# EAGLE design ftdi_rev_3 (EAGLE 6.3)
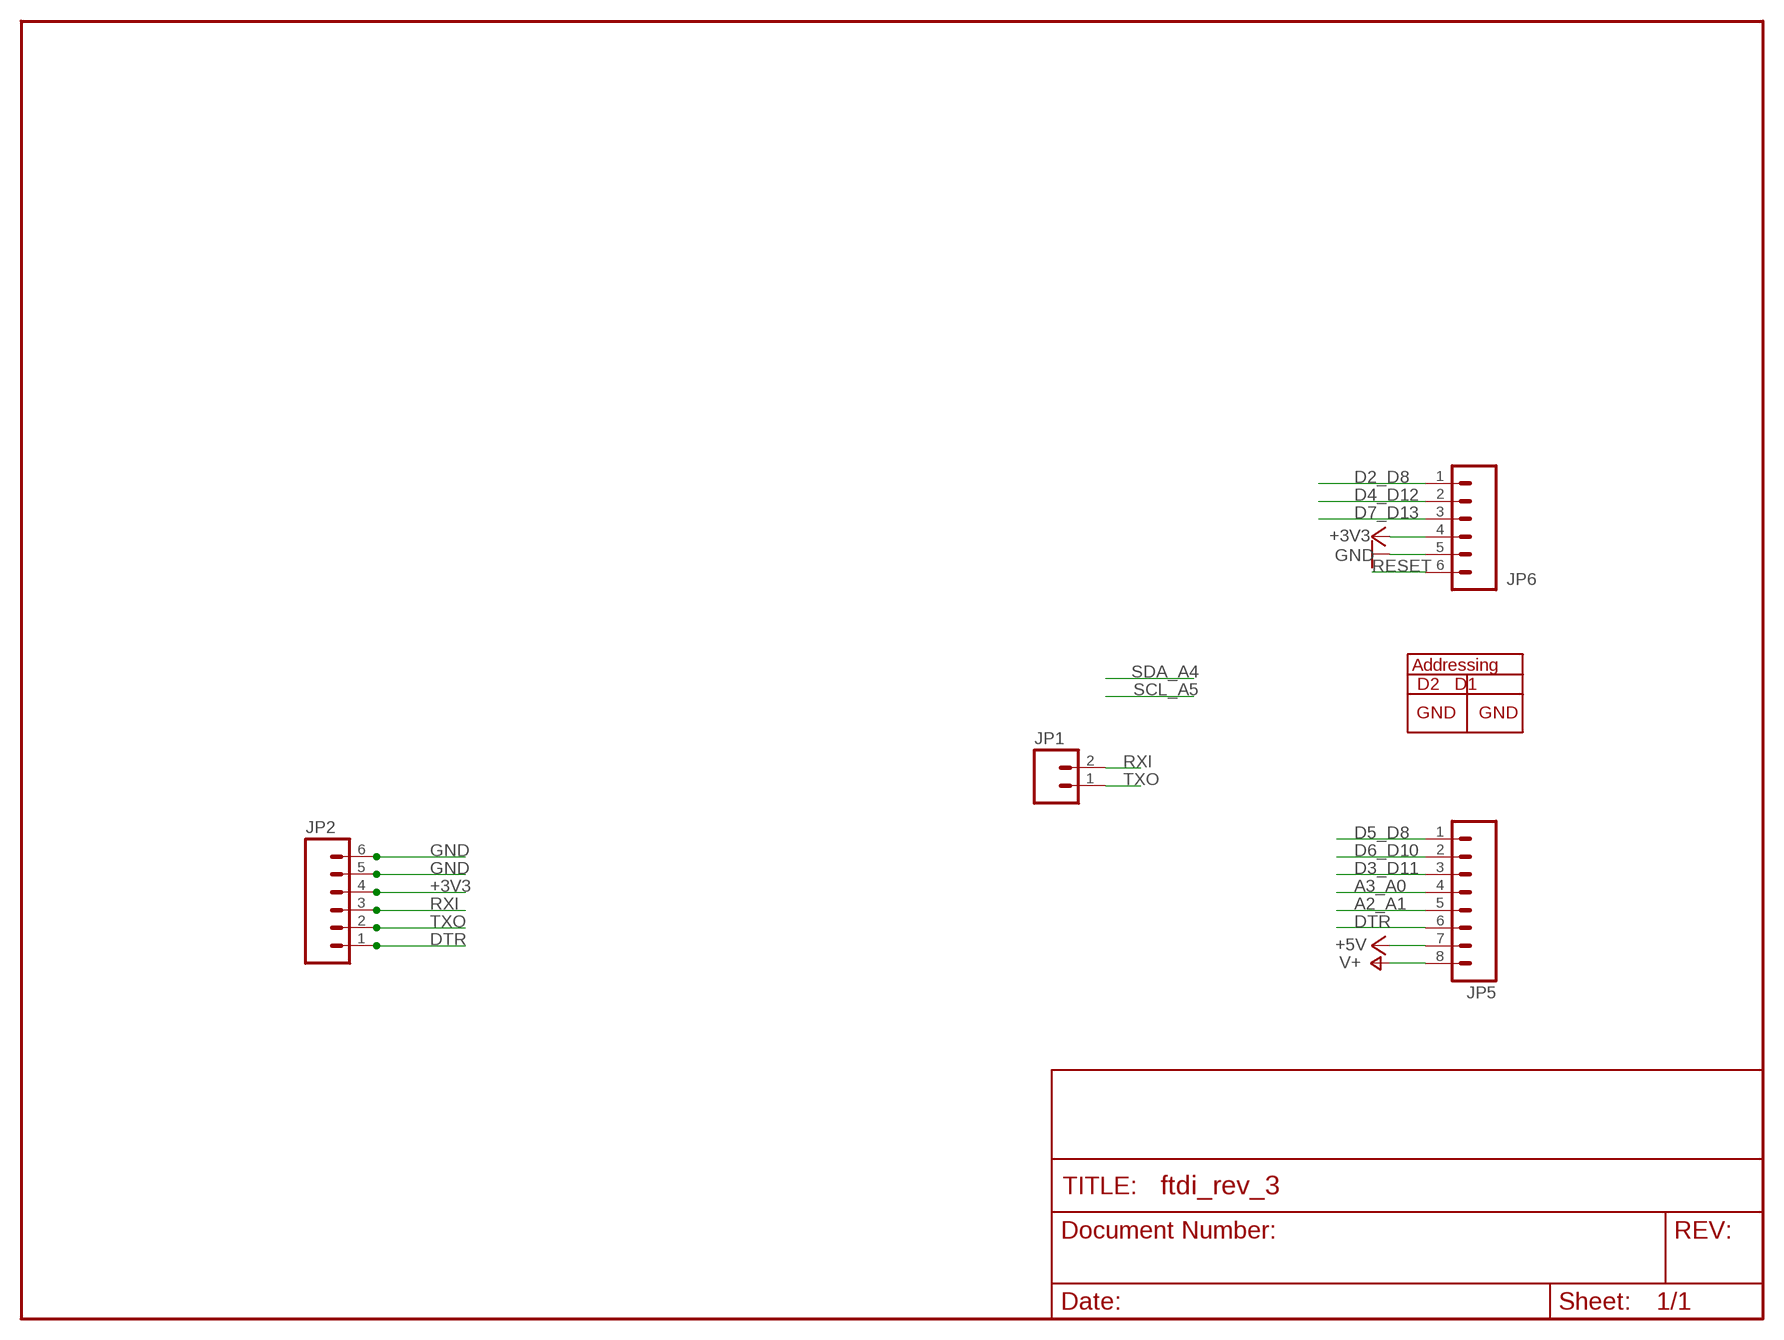
[diagram p0: schematic, sheet 1]

## Parts
JP1  M02PTH  [1X02]
JP2  M06SIP  [1X06]
JP5  M081X08  [1X08]
JP6  M06SIP  [1X06]

## Nets
+3V3: JP2.4 JP6.4
+5V: JP5.7
A2_A1: JP5.5
A3_A0: JP5.4
D2_D8: JP6.1
D3_D11: JP5.3
D4_D12: JP6.2
D5_D8: JP5.1
D6_D10: JP5.2
D7_D13: JP6.3
DTR: JP2.1 JP5.6
GND: JP2.5 JP2.6 JP6.5
RESET: JP6.6
RXI: JP1.2 JP2.3
TXO: JP1.1 JP2.2
V+: JP5.8

## Library data of the parts
JP1 = SparkFun_mod:M02: Header 2 Standard 2-pin 0.1" header. Use with straight break away headers (SKU : PRT-00116), right angle break away headers (PRT-00553), swiss pins (PRT-00743), machine pins (PRT-00117), and female headers (PRT-00115). Molex polarized connector foot print use with SKU : PRT-08233 with associated crimp pins and housings.
JP2 = SparkFun_mod:M06: Header 6 Standard 6-pin 0.1" header. Use with straight break away headers (SKU : PRT-00116), right angle break away headers (PRT-00553), swiss pins (PRT-00743), machine pins (PRT-00117), and female headers (PRT-00115). Molex polarized connector foot print use with SKU : PRT-08094 with associated crimp pins and housings. NOTES ON THE VARIANTS LOCK and LOCK_LONGPADS... This footprint was designed to help hold the alignment of a through-hole component (i.e. 6-pin header) while soldering it into place. You may notice that each hole has been shifted either up or down by 0.005 of an inch from it's more standard position (which is a perfectly straight line). This slight alteration caused the pins (the squares in the middle) to touch the edges of the holes. Because they are alternating, it causes a "brace" to hold the component in place. 0.005 has proven to be the perfect amount of "off-center" position when using our standard breakaway headers. Although looks a little odd when you look at the bare footprint, once you have a header in there, the alteration is very hard to notice. Also, if you push a header all the way into place, it is covered up entirely on the bottom side. This idea of altering the position of holes to aid alignment will be further integrated into the Sparkfun Library for other footprints. It can help hold any component with 3 or more connection pins.
JP5 = SparkFun_mod:M08: Header 8 Standard 8-pin 0.1" header. Use with straight break away headers (SKU : PRT-00116), right angle break away headers (PRT-00553), swiss pins (PRT-00743), machine pins (PRT-00117), and female headers (PRT-00115).
JP6 = SparkFun:M06: Header 6 Standard 6-pin 0.1" header. Use with straight break away headers (SKU : PRT-00116), right angle break away headers (PRT-00553), swiss pins (PRT-00743), machine pins (PRT-00117), and female headers (PRT-00115). Molex polarized connector foot print use with SKU : PRT-08094 with associated crimp pins and housings. NOTES ON THE VARIANTS LOCK and LOCK_LONGPADS... This footprint was designed to help hold the alignment of a through-hole component (i.e. 6-pin header) while soldering it into place. You may notice that each hole has been shifted either up or down by 0.005 of an inch from it's more standard position (which is a perfectly straight line). This slight alteration caused the pins (the squares in the middle) to touch the edges of the holes. Because they are alternating, it causes a "brace" to hold the component in place. 0.005 has proven to be the perfect amount of "off-center" position when using our standard breakaway headers. Although looks a little odd when you look at the bare footprint, once you have a header in there, the alteration is very hard to notice. Also, if you push a header all the way into place, it is covered up entirely on the bottom side. This idea of altering the position of holes to aid alignment will be further integrated into the Sparkfun Library for other footprints. It can help hold any component with 3 or more connection pins.

## Net classes
0 default: width 0.203 mm
1 vcc: width 0.254 mm

## Board
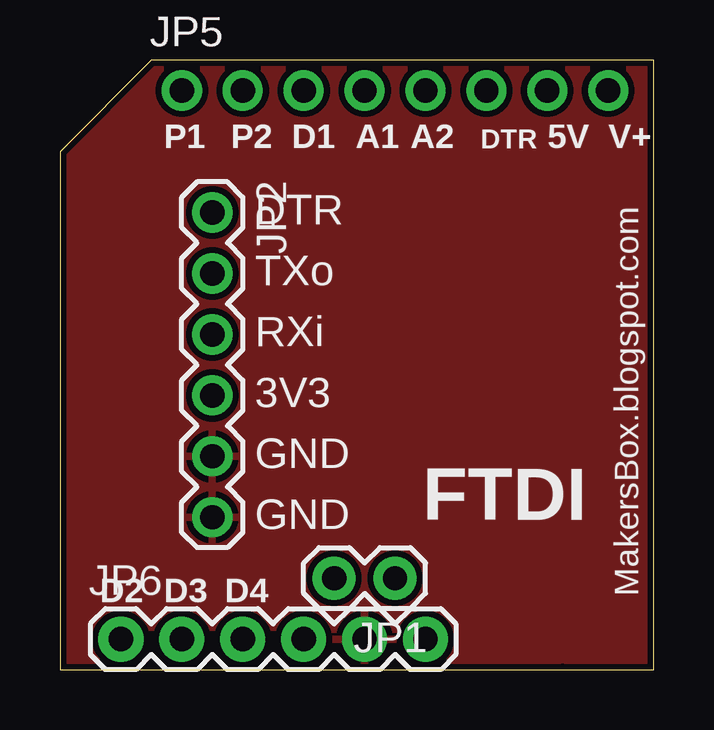
[diagram p1: board, top side]
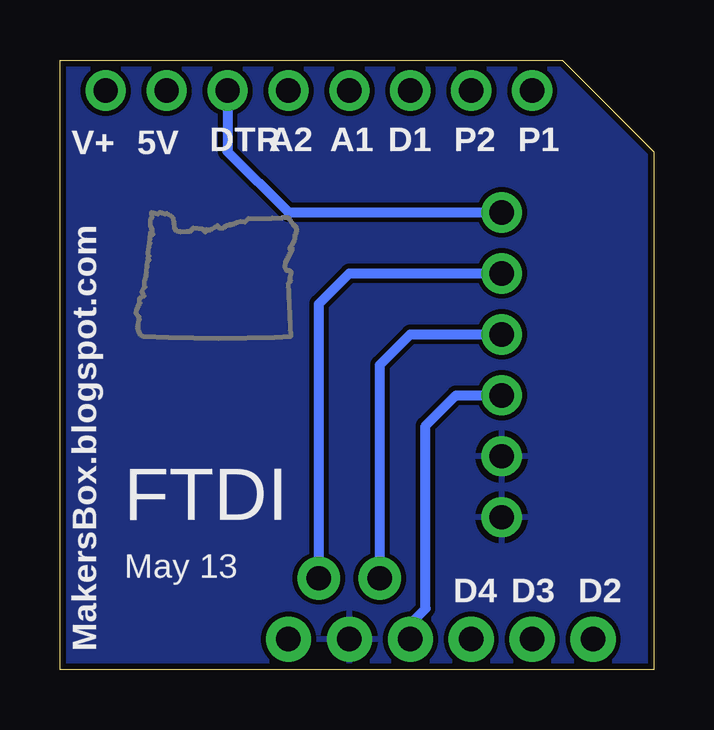
[diagram p2: board, bottom side, seen from below]

Size 24.77 x 25.4 mm. Coordinates in mm from the lower left corner, seen from the top.
Outline: 24.77,25.4 24.77,21.59 24.77,0 24.77,0 20.96,0 0,0 0,21.59
Outline: 24.77,25.4 3.81,25.4 0,21.59
Outline: 0,21.59 0,21.59
Copper layers (1*16): Top 0.035mm / dielectric 1.5mm / Bottom 0.035mm
Design rules "SparkFun": minimum track width 8mil, minimum drill 20mil, track to track 8mil, track to pad 8mil, pad to pad 8mil, via to via 8mil, smd to smd 8mil, copper to edge 10mil, drill to drill 8mil, minimum pad ring 12mil, minimum via ring 10mil, stop-mask expansion 4mil, vias tented up to drill 25mil, thermal gap 10mil

### Footprints (pad centres in the part's own frame; a part is rotated, then mirrored left to right if it is on the bottom)
1X02 = drill 1.016 pad 1.778: 1 0,0; 2 2.54,0
1X06 = drill 1.016 pad 1.676: 1 0,0; 2 2.54,0; 3 5.08,0; 4 7.62,0; 5 10.16,0; 6 12.7,0
1X08 = drill 1.016 pad 1.676: 1 0,0; 2 2.54,0; 3 5.08,0; 4 7.62,0; 5 10.16,0; 6 12.7,0; 7 15.24,0; 8 17.78,0
1X06' = drill 1.016 pad 1.88: 1 0,0; 2 2.54,0; 3 5.08,0; 4 7.62,0; 5 10.16,0; 6 12.7,0

### Placement (x,y rotation side)
JP1  13.97,3.81 180 top
JP2  6.35,19.05 270 top
JP5  5.08,24.13 0 top
JP6  [1X06']  2.54,1.27 0 top
U$1  [OREGON_18_52]  20.95,19.05 0 top

### Tracks (layer width: path | path; a pad name or v marks a point on that pad's centre or on a via)
+3V3
  Bottom 0.406: JP6.4 10.16,1.91 9.53,2.54 9.53,10.16 8.26,11.43 JP2.4
DTR
  Bottom 0.406: JP5.6 17.78,21.59 15.24,19.05 JP2.1
GND
  pour Bottom: -1.27,26.67 26.67,26.67 26.67,-1.27 -1.27,-1.27
  pour Top (isolate 0.254): -0.64,26.04 26.67,26.04 26.67,0 26.04,-0.64 -0.64,-0.64
RXI
  Bottom 0.406: JP1.2 11.43,12.7 10.16,13.97 JP2.3
TXO
  Bottom 0.406: JP1.1 13.97,15.24 12.7,16.51 JP2.2

### Text on the board
tPlace: P1 | P2 | D1 | A1 | A2 | DTR | 5V | V+ | DTR | MakersBox.blogspot.com | TXo | RXi | 3V3 | GND | GND | FTDI | D2 | D3 | D4
bPlace: P1 | P2 | D1 | A1 | A2 | DTR | 5V | V+ | FTDI | May 13 | D2 | D3 | D4 | MakersBox.blogspot.com